# EAGLE design PDU (EAGLE 6.5.0)
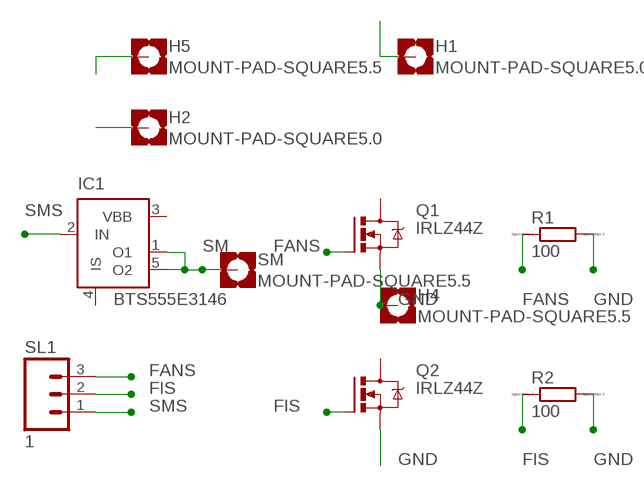
[diagram p0: schematic, sheet 1]

## Parts
H1  MOUNT-PAD-SQUARE5.0  [5,0-PAD-SQUARE]
H2  MOUNT-PAD-SQUARE5.0  [5,0-PAD-SQUARE]
H4  MOUNT-PAD-SQUARE5.5  [5,5-PAD-SQUARE]
H5  MOUNT-PAD-SQUARE5.5  [5,5-PAD-SQUARE]
IC1  BTS555E3146  [TO220-52]
Q1  IRLZ44Z  [TO220BH]
Q2  IRLZ44Z  [TO220BH]
R1  100  RR1206  [R1206]
R2  100  RR1206  [R1206]
SL1  1  M03  [03P]
SM  MOUNT-PAD-SQUARE5.5  [5,5-PAD-SQUARE]

## Nets
FANS: Q1.G R1.1 SL1.3
FIS: Q2.G R2.1 SL1.2
GND: H4.B5,5(MOUNT) Q1.S Q2.S R1.2 R2.2
H1: H1.B5(MOUNT)
H2: H2.B5(MOUNT)
H5: H5.B5,5(MOUNT)
SM: IC1.1(O1) IC1.5(O2) SM.B5,5(MOUNT)
SMS: IC1.2(IN) SL1.1
Unconnected: IC1.3(VBB) IC1.4(IS) Q1.D Q2.D

## Library data of the parts
H1 H2 H4 H5 SM = holes:MOUNT-PAD-SQUARE: MOUNTING PAD, square
IC1 = infineon:BTS555: PROFET® Data Sheet BTS555 Source: http://www.infineon.com/upload/Document/cmc_upload/documents/011/8726/Datasheet_BTS555.pdf; OC_FARNELL: unknown; OC_NEWARK: unknown
Q1 Q2 = transistor-power:IRLZ44Z: N-Channel HEXFET® Power MOSFET Logic Level AUTOMOTIVE MOSFET Source: http://www.irf.com/product-info/datasheets/data/irlz44zpbf.pdf
R1 R2 = eagle-ltspice:R: RESISTOR, European symbol; SPICEMODEL: NONE; SPICEPREFIX: R
SL1 = con-amp-quick:M03: AMP QUICK CONNECTOR; OC_FARNELL: unknown; OC_NEWARK: unknown

## Board
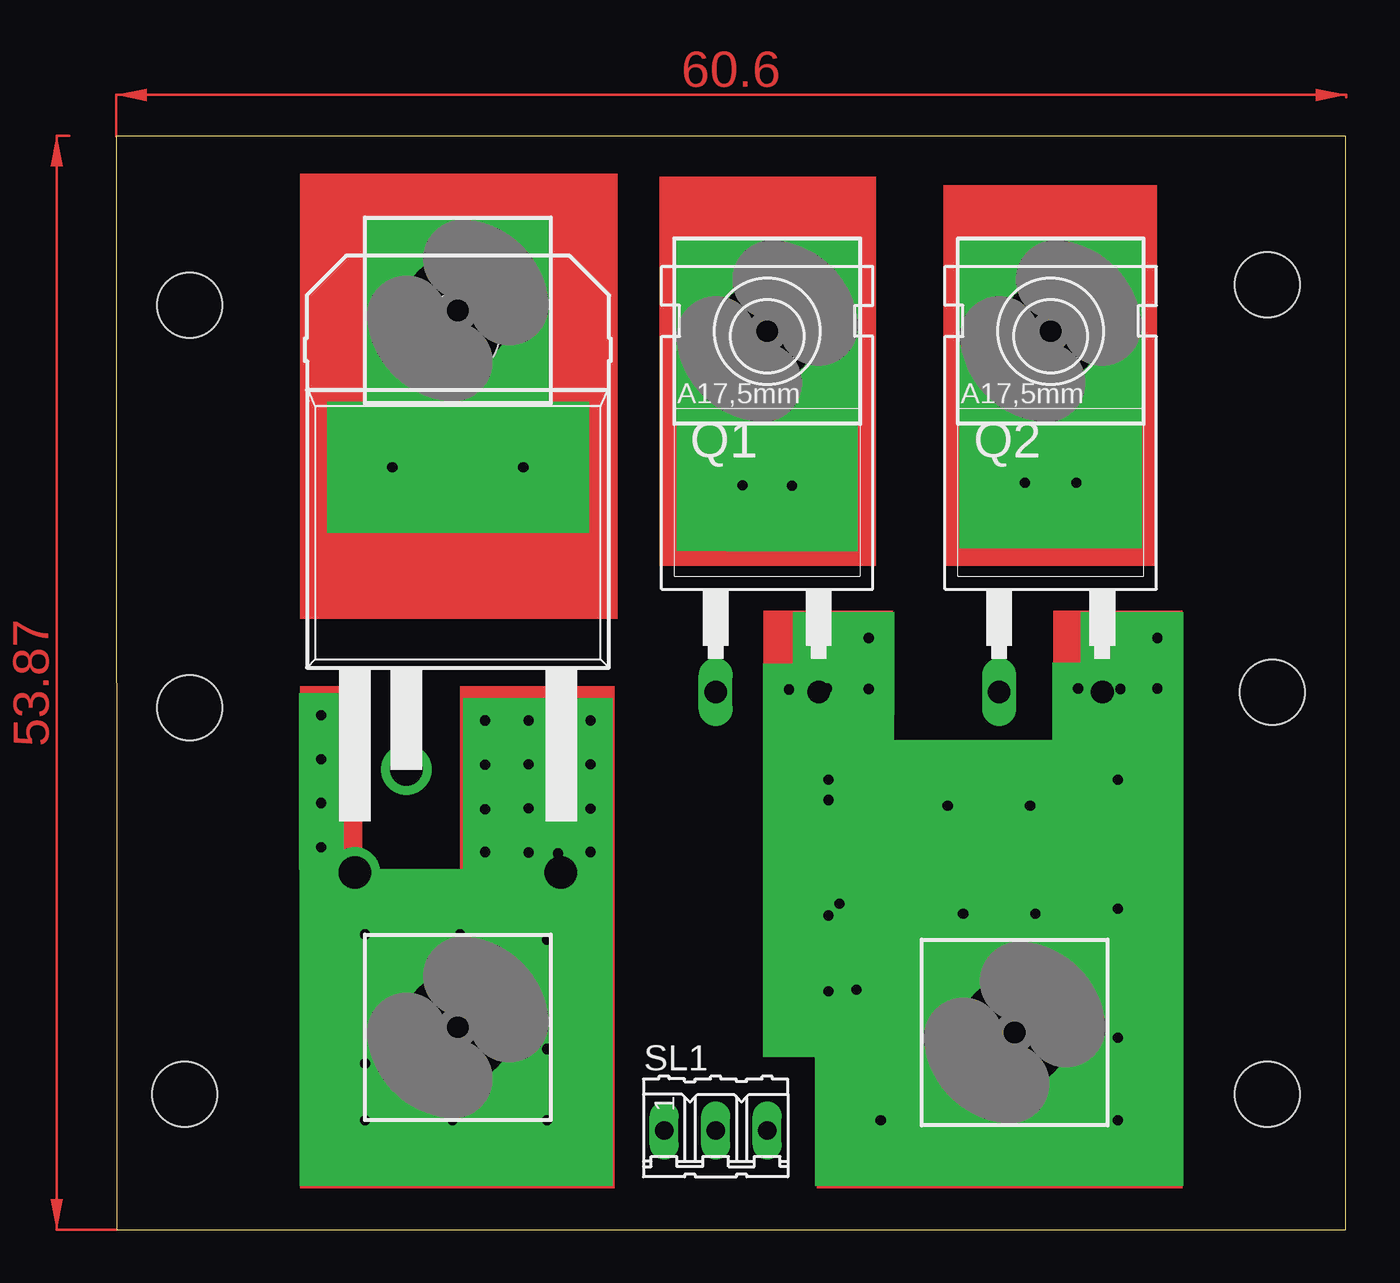
[diagram p1: board, top side]
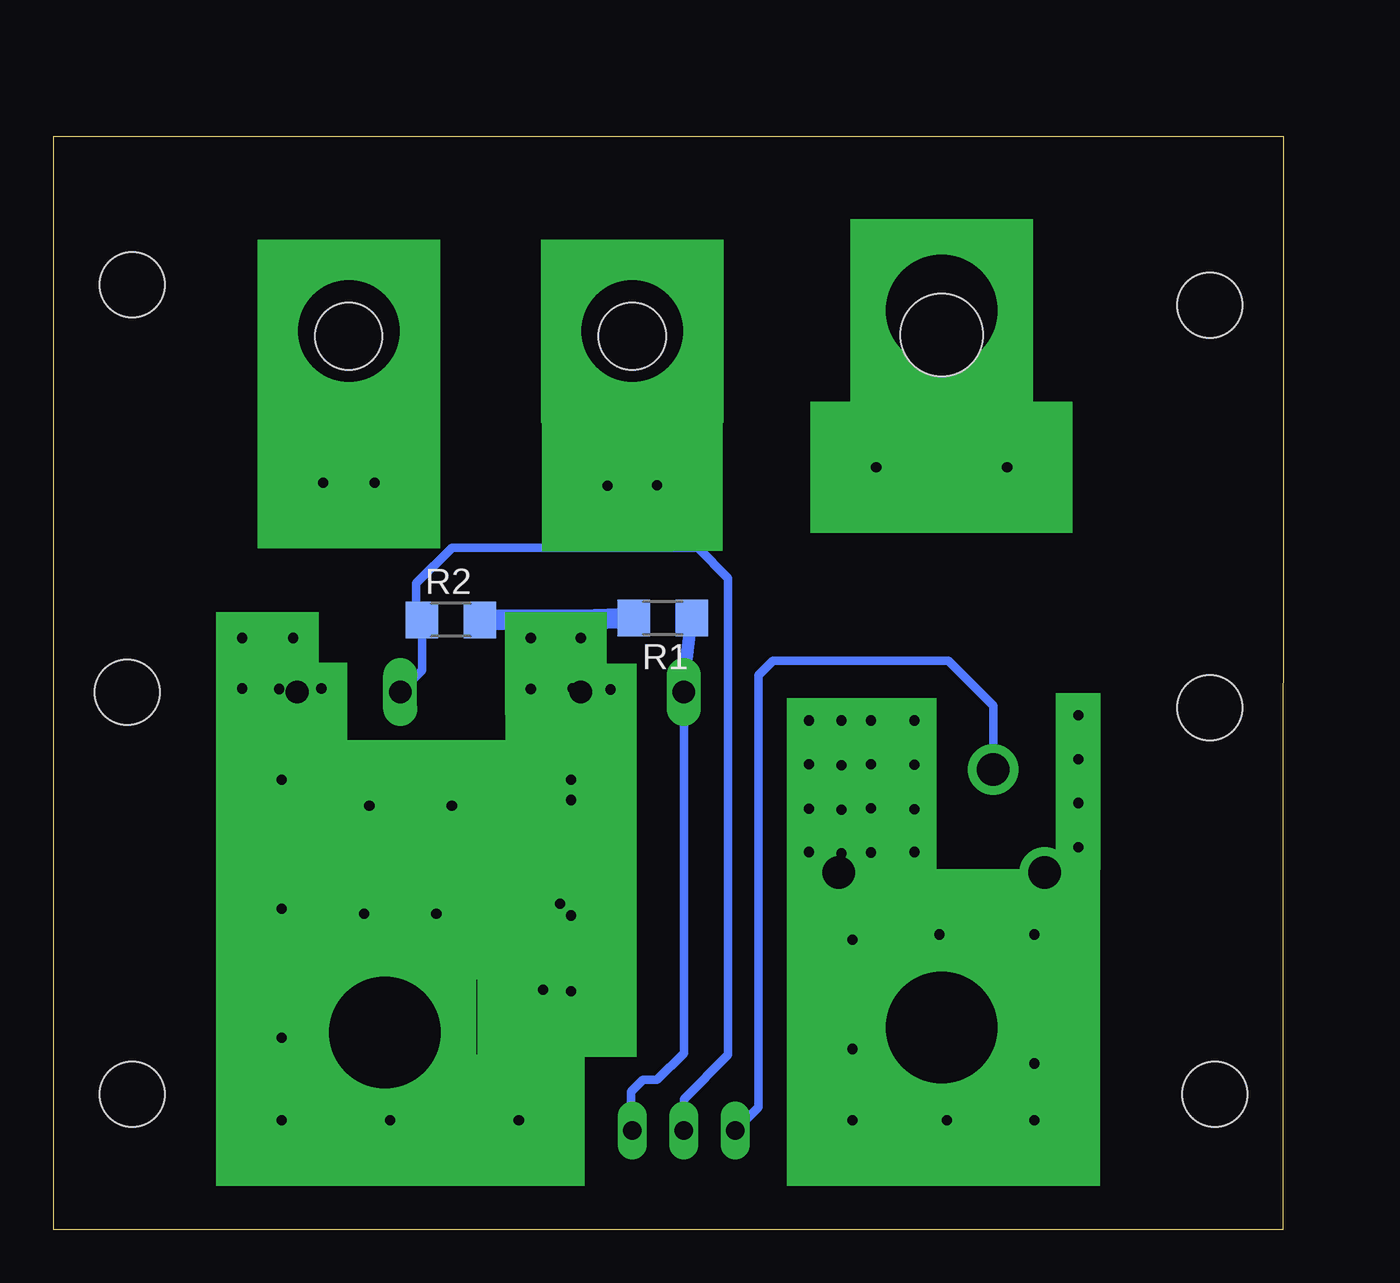
[diagram p2: board, bottom side, seen from below]

Size 60.58 x 53.85 mm. Coordinates in mm from the lower left corner, seen from the top.
Outline: 0.03,0 60.58,0 60.58,53.85 0,53.85 0.03,0
Copper layers (1*16): Top 0.035mm / dielectric 1.5mm / Bottom 0.035mm
Design rules "default": minimum track width 10mil, minimum drill 24mil, track to track 8mil, track to pad 8mil, pad to pad 8mil, via to via 8mil, smd to smd 8mil, copper to edge 40mil, drill to drill 8mil, minimum pad ring 10mil, minimum via ring 8mil, stop-mask expansion 4mil, vias tented up to drill 0mil, thermal gap 10mil
Holes 3.2 mm at 3.63,45.52 3.63,25.7 3.38,6.65 56.72,6.65 56.97,26.47 56.72,46.53

### Footprints (pad centres in the part's own frame; a part is rotated, then mirrored left to right if it is on the bottom)
5,0-PAD-SQUARE = drill 5 pad 9 square: B5 0,0
5,5-PAD-SQUARE = drill 5.5 pad 9 square: B5,5 0,0
TO220-52 = drill 1.6 pad 2.5: 1 -5.08,-30.48; 2 -2.54,-25.4; 3 -2.54,-25.4; 4 -2.54,-25.4; 5 5.08,-30.48 | hole 4.05: 0,-4
TO220BH = drill 1.118 long: D 2.54,-6.35; G -2.54,-6.35; S 2.54,-6.35 | hole 3.302: 0,11.176
R1206 = smd 1.6 x 1.803: 1 -1.422,0; 2 1.422,0
03P = drill 0.914 long: 1 -2.54,0; 2 0,0; 3 2.54,0

### Placement (x,y rotation side)
H1  32.08,44.25 0 top
H2  46.05,44.25 0 top
H4  44.27,9.7 0 top
H5  16.84,45.26 0 top
IC1  16.84,48.06 0 top
Q1  32.08,32.82 0 top
Q2  46.05,32.82 0 top
R1  30.58,30.12 180 bottom
R2  41.02,30.02 0 bottom
SL1  29.54,4.88 0 top
SM  16.84,9.96 0 top

### Tracks (layer width: path | path; a pad name or v marks a point on that pad's centre or on a via)
FANS
  Bottom 0.305: 31.95,5 SL1.3
  Bottom 0.406: Q1.G 29.54,8.69 30.86,7.37 31.55,7.37 32.13,6.78 32.13,4.93 SL1.3
  Bottom 0.61: Q1.G 29.54,27.08 R1.1
FIS
  Bottom 0.406: SL1.2 29.54,6.43 27.36,8.61 27.36,32.08 28.85,33.58 40.97,33.58 42.72,31.83 42.72,30.3 R2.1 42.44,27.53 Q2.G
GND  (via drill 0.5 pad 2.54, 0.5 pad 6.45)
  Top 0.406: H4.B5,5 44.02,9.7 v44.02,5.38 | v51.31,26.64 48.72,26.64 | Q2.S 48.72,26.64 | 48.72,26.64 48.72,26.34 | 48.72,26.34 48.59,26.34 48.59,25.96 48.72,25.96 48.72,26.09 | 48.72,26.34 49.1,26.34 49.1,26.09 48.72,26.09 | 48.72,26.09 48.72,26.34
  Bottom 1.016: R1.2 34.62,30.02 | 34.62,30.02 R2.2 | Q1.S v34.62,29.13 34.62,30.02
  other vias: 35.1,22.15 35.1,21.16 40.97,20.88 45.03,20.88 49.35,22.15 49.35,15.8 49.35,9.45 49.35,5.38 37.67,5.38 36.47,11.81 35.1,11.73 35.1,15.47 35.64,16.05 41.73,15.54 45.29,15.54 37.08,26.62 37.08,29.13 48.79,29.13 51.31,29.13 33.15,26.59 47.4,26.64 35.03,26.64 49.48,26.62
  pour Top: 52.4,30.28 52.4,2.34 34.62,2.34 34.62,8.69 32,8.66 32,30.33 38.18,30.28 38.18,23.93 46.3,23.93 46.3,30.28
H1  (via drill 0.5 pad 6.45)
  Top 0.406: v30.86,36.65 v33.3,36.63
  pour Top: 27,51.61 27,32.82 37.16,32.82 37.16,51.61
H2  (via drill 0.5 pad 6.45)
  Top 0.406: v44.78,36.78 v47.32,36.78
  pour Top: 40.97,32.82 40.97,51.36 51.13,51.36 51.13,32.82
H5  (via drill 0.5 pad 6.45)
  Top 0.406: v20.07,37.54 v13.61,37.54
  pour Top: 10.24,51.87 9.22,50.6 9.22,30.28 24.46,30.28 24.46,51.77
SM  (via drill 0.5 pad 2.18, 0.5 pad 6.45)
  Top 0.406: v12.27,14.53 11.76,14.53 IC1.1 | v23.37,18.59 22.05,18.59 22.05,17.32 | v21.23,5.38 21.92,5.36 IC1.5 | v10.11,18.82 10.11,7.54 v12.27,5.38 v16.59,5.38
  other vias: 12.27,8.18 21.23,14.27 21.23,8.89 23.37,25.07 23.37,22.91 23.37,20.73 21.77,25.07 21.77,22.86 21.77,20.68 21.77,18.52 20.32,25.07 20.32,22.91 20.32,20.75 20.32,18.57 10.11,25.32 10.11,23.16 10.11,21.01 16.94,14.53 18.19,25.07 18.19,22.89 18.19,20.7 18.19,18.59
  pour Top: 9.22,26.47 9.22,2.34 24.46,2.34 24.46,26.47 17.22,26.52 17.22,17.63 11.76,17.58 11.76,26.47
SMS
  Bottom 0.406: IC1.2 14.3,25.81 16.51,28.02 25.15,28.02 25.86,27.3 25.86,6.02 SL1.1
(copper drawn outside any net)
  shapes: Top area x11